# EAGLE design cv (EAGLE 7.4.0)
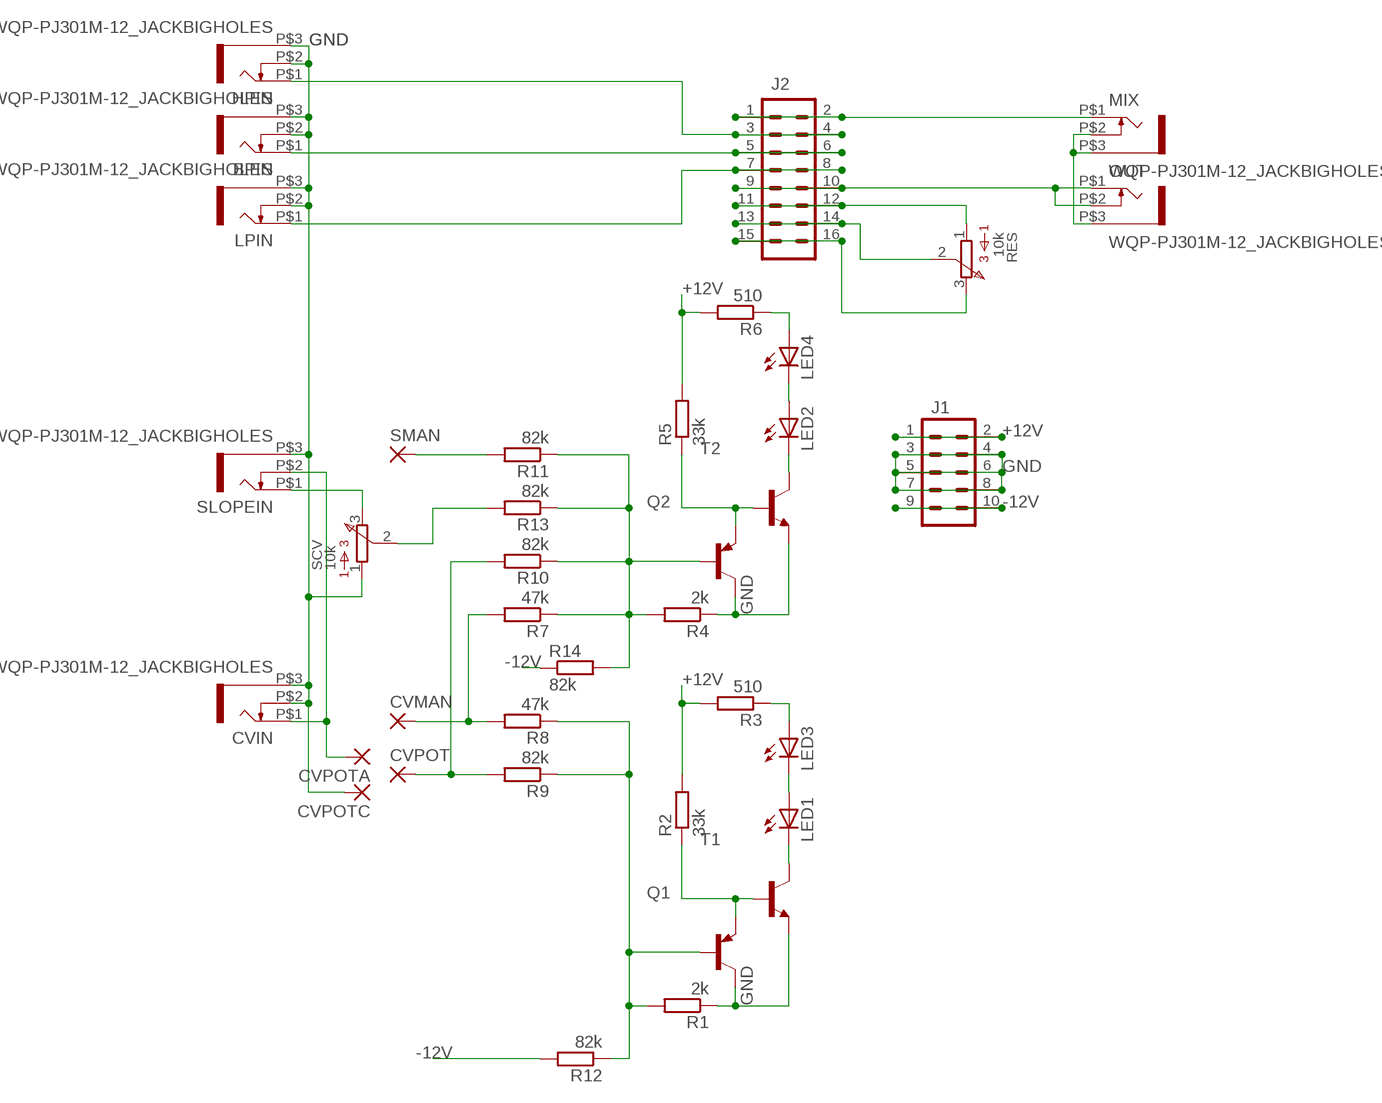
[diagram p0: schematic, sheet 1]

## Parts
BPIN  WQP-PJ301M-12_JACKBIGHOLES  [WQP-PJ301M-12_JACK]
CVIN  WQP-PJ301M-12_JACKBIGHOLES  [WQP-PJ301M-12_JACK]
CVMAN  2,0/0,9-S  [2,0/0,9-S]
CVPOT  2,0/0,9-S  [2,0/0,9-S]
CVPOTA  2,0/0,9-S  [2,0/0,9-S]
CVPOTC  2,0/0,9-S  [2,0/0,9-S]
HPIN  WQP-PJ301M-12_JACKBIGHOLES  [WQP-PJ301M-12_JACK]
J1  M05X2PTH  [AVR_ICSP]
J2  M08X2  [2X8]
LED1  LEDCHIP-LED0805  [CHIP-LED0805]
LED2  LEDCHIP-LED0805  [CHIP-LED0805]
LED3  LED5MM  [LED5MM]
LED4  LED5MM  [LED5MM]
LPIN  WQP-PJ301M-12_JACKBIGHOLES  [WQP-PJ301M-12_JACK]
MIX  WQP-PJ301M-12_JACKBIGHOLES  [WQP-PJ301M-12_JACK]
OUT  WQP-PJ301M-12_JACKBIGHOLES  [WQP-PJ301M-12_JACK]
Q1  MMBT3906LT1-PNP-SOT23-BEC  [SOT23-BEC]
Q2  MMBT3906LT1-PNP-SOT23-BEC  [SOT23-BEC]
R1  2k  R-EU_R1206  [R1206]
R2  33k  R-EU_R1206  [R1206]
R3  510  R-EU_R1206  [R1206]
R4  2k  R-EU_R1206  [R1206]
R5  33k  R-EU_R1206  [R1206]
R6  510  R-EU_R1206  [R1206]
R7  47k  R-EU_R1206  [R1206]
R8  47k  R-EU_R1206  [R1206]
R9  82k  R-EU_R1206  [R1206]
R10  82k  R-EU_R1206  [R1206]
R11  82k  R-EU_R1206  [R1206]
R12  82k  R-EU_R1206  [R1206]
R13  82k  R-EU_R1206  [R1206]
R14  82k  R-EU_R1206  [R1206]
RES  10k  91  [91]
SCV  10k  91  [91]
SLOPEIN  WQP-PJ301M-12_JACKBIGHOLES  [WQP-PJ301M-12_JACK]
SMAN  2,0/0,9-S  [2,0/0,9-S]
T1  MMBT3904LT1-NPN-SOT23-BEC  [SOT23-BEC]
T2  MMBT3904LT1-NPN-SOT23-BEC  [SOT23-BEC]

## Nets
+12V: J1.1 J1.2 R2.2 R3.2 R5.2 R6.2
-12V: J1.9 J1.10 R12.2 R14.1
GND: BPIN.P$2 BPIN.P$3 CVIN.P$2 CVIN.P$3 CVPOTC.1(P) HPIN.P$2 HPIN.P$3 J1.3 J1.4 J1.5 J1.6 J1.7 J1.8 LPIN.P$2 LPIN.P$3 MIX.P$2 MIX.P$3 OUT.P$3 Q1.C Q2.C R1.1 R4.1 SCV.1 SLOPEIN.P$3 T1.E T2.E
N$1: J2.1 J2.2 MIX.P$1
N$2: J2.7 J2.8 LPIN.P$1
N$3: J2.9 J2.10 OUT.P$1 OUT.P$2
N$4: CVIN.P$1 CVPOTA.1(P) SLOPEIN.P$2
N$5: SCV.3 SLOPEIN.P$1
N$7: BPIN.P$1 J2.5 J2.6
N$8: LED3.A R3.1
N$9: R13.2 SCV.2
N$10: CVPOT.1(P) R9.2 R10.2
N$11: Q1.B R1.2 R8.1 R9.1 R12.1
N$12: R11.2 SMAN.1(P)
N$13: CVMAN.1(P) R7.2 R8.2
N$14: Q1.E R2.1 T1.B
N$15: LED1.C T1.C
N$16: LED1.A LED3.K(C)
N$18: Q2.E R5.1 T2.B
N$19: HPIN.P$1 J2.3 J2.4
N$20: LED2.C T2.C
N$21: LED2.A LED4.K(C)
N$22: LED4.A R6.1
N$23: Q2.B R4.2 R7.1 R10.1 R11.1 R13.1 R14.2
RESPOTA: J2.11 J2.12 RES.1
RESPOTB: J2.13 J2.14 RES.2
RESPOTC: J2.15 J2.16 RES.3

## Library data of the parts
BPIN CVIN HPIN LPIN MIX OUT SLOPEIN = thonkiconn:WQP-PJ301M-12_JACK
CVMAN CVPOT CVPOTA CVPOTC SMAN = synthdiy:2,0/0,9-S: SQUARE THROUGH-HOLE PAD 2.0 mm, 0.9 mm/0.079",0.035"
J1 = SparkFun-Connectors:M05X2: Header 5x2 Standard 10-pin dual row 0.1" header. Commonly used with AVR-ISP. Use with Spark Fun Electronics SKU: PRT-00778
J2 = SparkFun-Connectors:M08X2: .1" headers, two rows of 8 each
LED1-LED4 = led:LED: LED OSRAM: - CHIPLED LG R971, LG N971, LY N971, LG Q971, LY Q971, LO R971, LY R971 LH N974, LH R974 LS Q976, LO Q976, LY Q976 LO Q996 - Hyper CHIPLED LW Q18S LB Q993, LB Q99A, LB R99A - SideLED LS A670, LO A670, LY A670, LG A670, LP A670 LB A673, LV A673, LT A673, LW A673 LH A674 LY A675 LS A676, LA A676, LO A676, LY A676, LW A676 LS A679, LY A679, LG A679 - Hyper Micro SIDELED® LS Y876, LA Y876, LO Y876, LY Y876 LT Y87S - SmartLED LW L88C, LW L88S LB L89C, LB L89S, LG L890 LS L89K, LO L89K, LY L89K LS L896, LA L896, LO L896, LY L896 - TOPLED LS T670, LO T670, LY T670, LG T670, LP T670 LSG T670, LSP T670, LSY T670, LOP T670, LYG T670 LG T671, LOG T671, LSG T671 LB T673, LV T673, LT T673, LW T673 LH T674 LS T676, LA T676, LO T676, LY T676, LB T676, LH T676, LSB T676, LW T676 LB T67C, LV T67C, LT T67C, LS T67K, LO T67K, LY T67K, LW E67C LS E67B, LA E67B, LO E67B, LY E67B, LB E67C, LV E67C, LT E67C LW T67C LS T679, LY T679, LG T679 LS T770, LO T770, LY T770, LG T770, LP T770 LB T773, LV T773, LT T773, LW T773 LH T774 LS E675, LA E675, LY E675, LS T675 LS T776, LA T776, LO T776, LY T776, LB T776 LHGB T686 LT T68C, LB T68C - Hyper Mini TOPLED® LB M676 - Mini TOPLED Santana® LG M470 LS M47K, LO M47K, LY M47K Source: http://www.osram.convergy.de LUXEON: - LUMILED® LXK2-PW12-R00, LXK2-PW12-S00, LXK2-PW14-U00, LXK2-PW14-V00 LXK2-PM12-R00, LXK2-PM12-S00, LXK2-PM14-U00 LXK2-PE12-Q00, LXK2-PE12-R00, LXK2-PE12-S00, LXK2-PE14-T00, LXK2-PE14-U00 LXK2-PB12-K00, LXK2-PB12-L00, LXK2-PB12-M00, LXK2-PB14-N00, LXK2-PB14-P00, LXK2-PB14-Q00 LXK2-PR12-L00, LXK2-PR12-M00, LXK2-PR14-Q00, LXK2-PR14-R00 LXK2-PD12-Q00, LXK2-PD12-R00, LXK2-PD12-S00 LXK2-PH12-R00, LXK2-PH12-S00 LXK2-PL12-P00, LXK2-PL12-Q00, LXK2-PL12-R00 Source: www.luxeon.com KINGBRIGHT: KA-3528ASYC Source: www.kingbright.com
Q1 Q2 = transistor:*-PNP-: PNP Transistror
R1-R14 = resistor:R-EU_: RESISTOR, European symbol
RES SCV = bourns:91: 91 Series Potentiometer
T1 T2 = transistor:*-NPN-: NPN Transistror BF959 corrected 2008.03.06

## Board
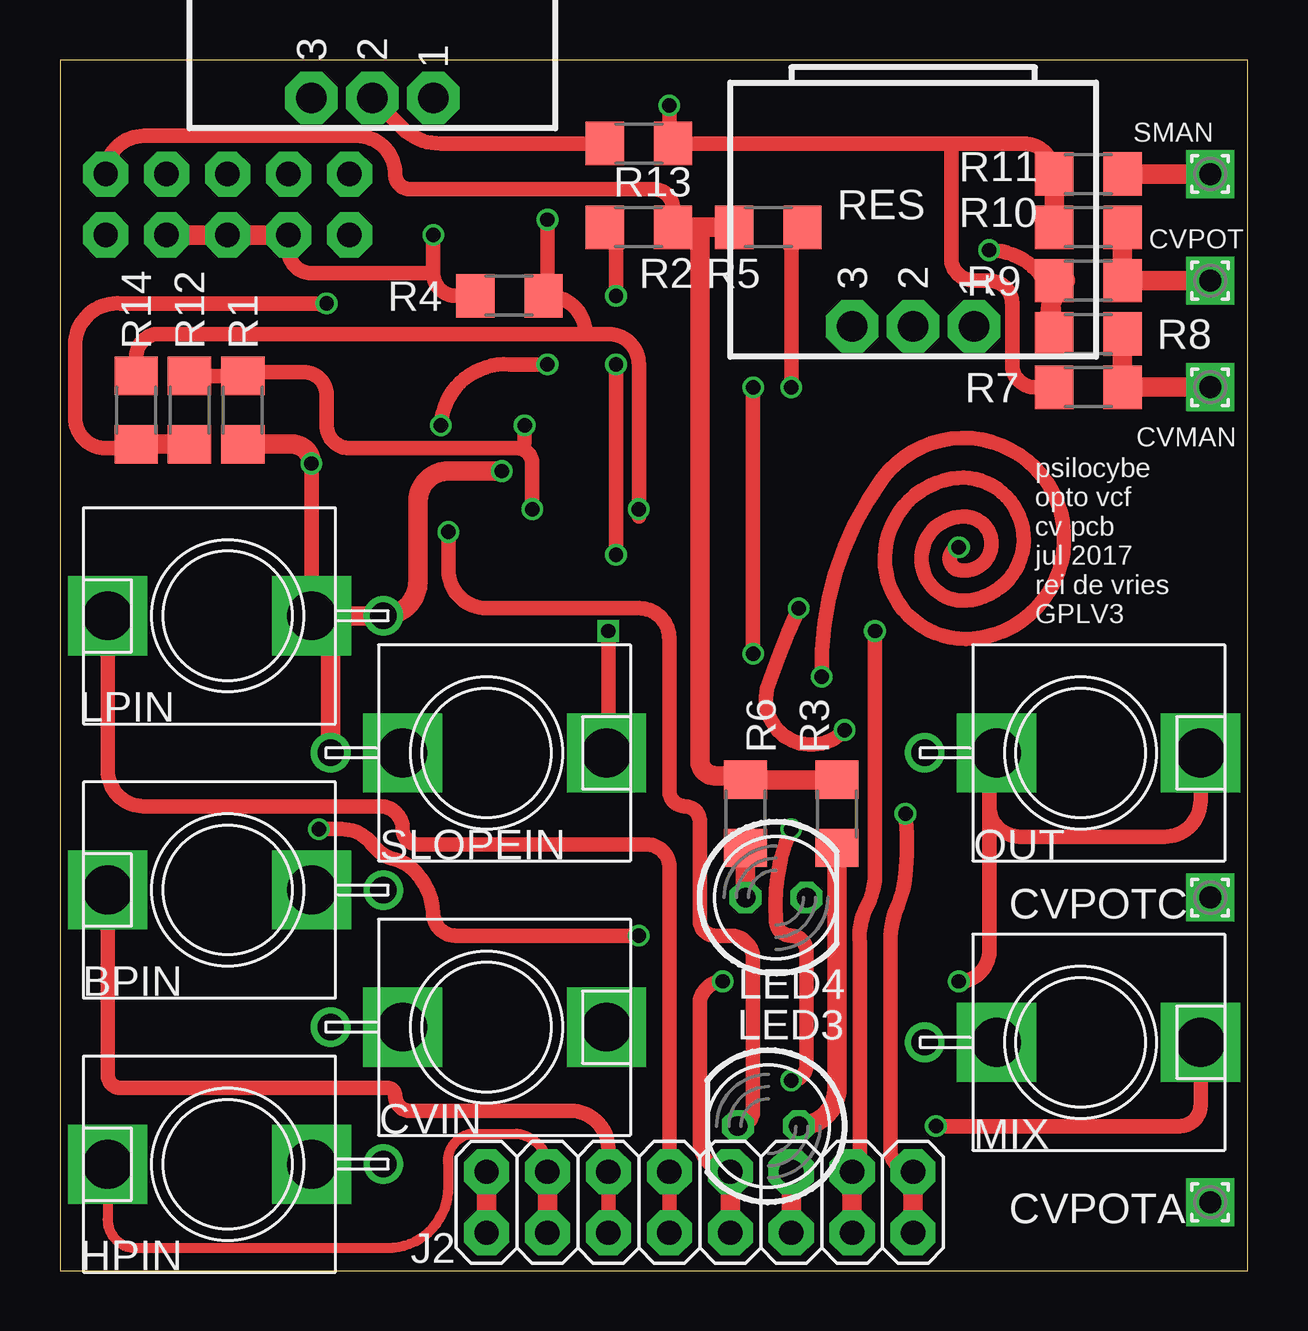
[diagram p1: board, top side]
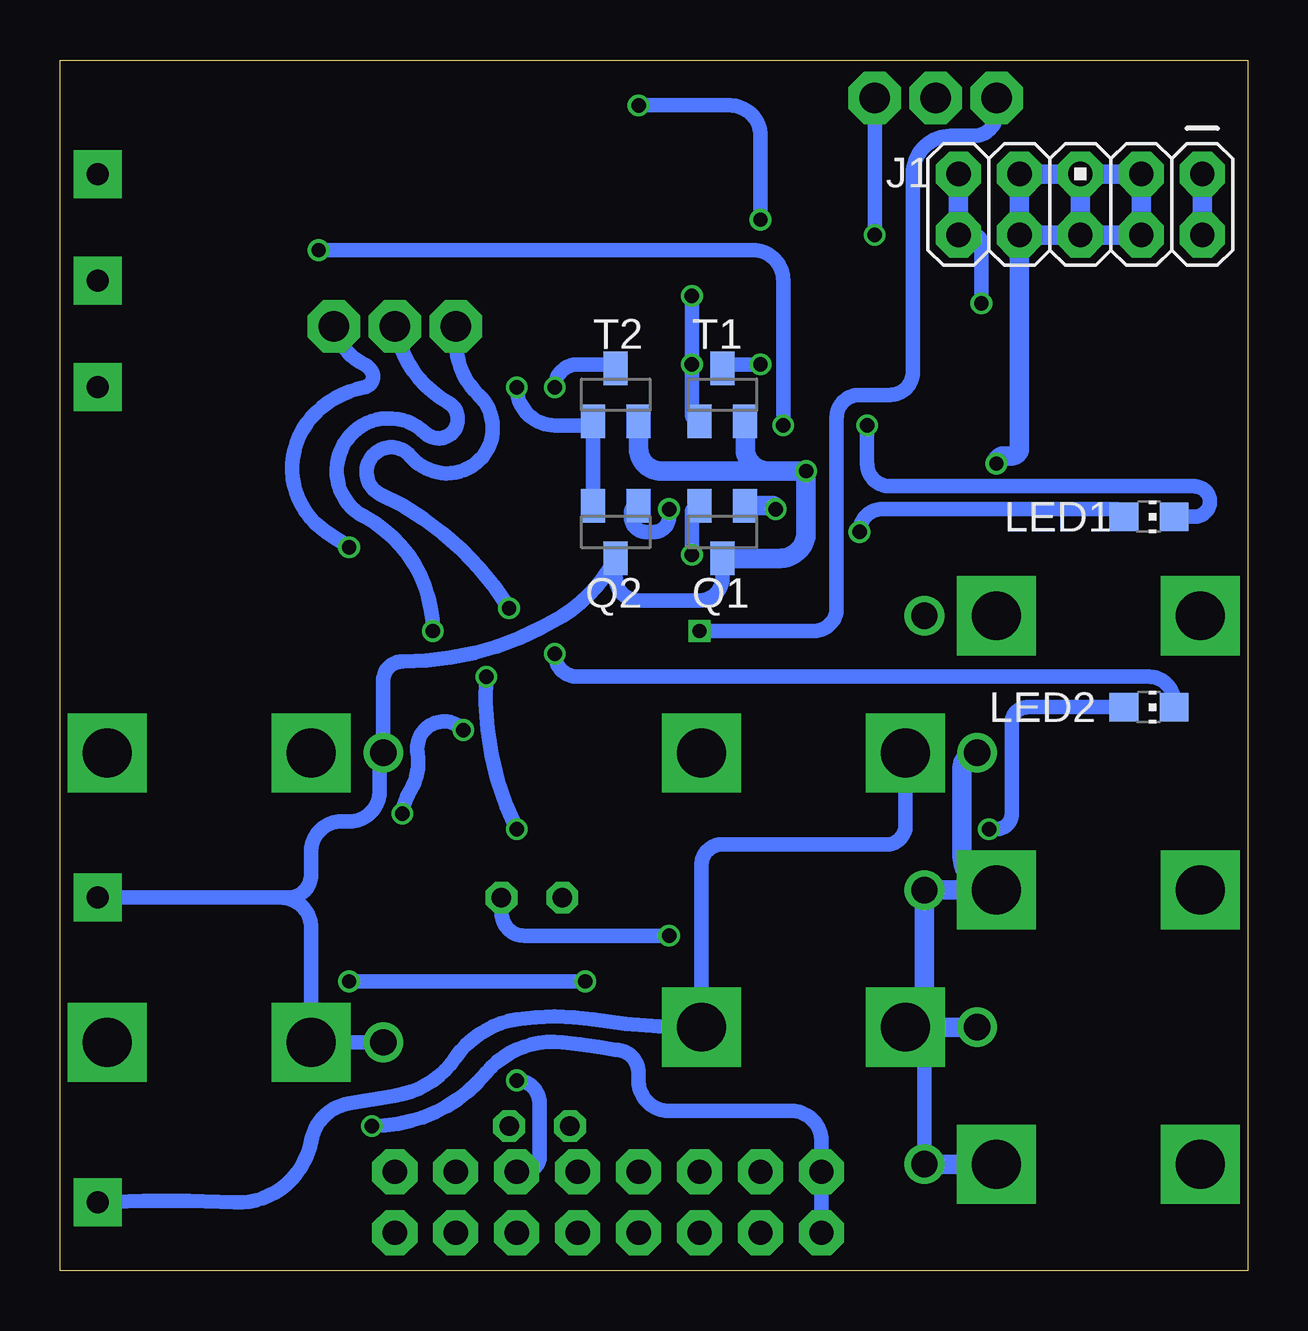
[diagram p2: board, bottom side, seen from below]

Size 49.52 x 50.47 mm. Coordinates in mm from the lower left corner, seen from the top.
Outline: 0,0 49.52,0 49.52,50.47 0,50.47 0,0
Copper layers (1*16): Top 0.035mm / dielectric 1.5mm / Bottom 0.035mm
Design rules "SeeedStudio_2layer_DRU_no_angle_20140221": minimum track width 6mil, minimum drill 12mil, track to track 6mil, track to pad 6mil, pad to pad 6mil, via to via 6mil, smd to smd 0mil, copper to edge 10mil, drill to drill 10mil, minimum pad ring 10mil, minimum via ring 6mil, stop-mask expansion 2mil, vias tented up to drill 100mil, thermal gap 10mil

### Footprints (pad centres in the part's own frame; a part is rotated, then mirrored left to right if it is on the bottom)
WQP-PJ301M-12_JACK = drill 2.032 pad 3.302 square: P$1 0,5; P$2 0,-3.5 | drill 1.1: P$3 0,-6.5
2,0/0,9-S = drill 0.914 pad 2 square: 1 0,0
AVR_ICSP = drill 1.016 pad 1.88 octagon: 1 -1.27,5.08; 2 1.27,5.08; 3 -1.27,2.54; 4 1.27,2.54; 5 -1.27,0; 6 1.27,0; 7 -1.27,-2.54; 8 1.27,-2.54; 9 -1.27,-5.08; 10 1.27,-5.08
2X8 = drill 1.016 pad 1.88 octagon: 1 0,0; 2 0,2.54; 3 2.54,0; 4 2.54,2.54; 5 5.08,0; 6 5.08,2.54; 7 7.62,0; 8 7.62,2.54; 9 10.16,0; 10 10.16,2.54; 11 12.7,0; 12 12.7,2.54; 13 15.24,0; 14 15.24,2.54; 15 17.78,0; 16 17.78,2.54
CHIP-LED0805 = smd 1.2 x 1.2: A 0,-1.05; C 0,1.05
LED5MM = drill 0.813 octagon: A -1.27,0; K 1.27,0
SOT23-BEC = smd 1 x 1.4: B -0.95,-1.1; C 0,1.1; E 0.95,-1.1
R1206 = smd 1.6 x 1.803: 1 -1.422,0; 2 1.422,0
91 = drill 1.27 pad 2.184 octagon: 1 0,2.54; 2 0,0; 3 0,-2.54

### Placement (x,y rotation side)
BPIN  6.99,15.88 90 top
CVIN  17.78,10.16 270 top
CVMAN  47.94,36.83 0 top
CVPOT  47.94,41.27 0 top
CVPOTA  47.94,2.86 0 top
CVPOTC  47.94,15.56 0 top
HPIN  6.99,4.45 90 top
J1  6.99,44.45 270 bottom
J2  17.78,1.59 0 top
LED1  4.13,31.43 270 bottom
LED2  4.13,23.5 270 bottom
LED3  29.53,6.03 180 top
LED4  29.84,15.56 0 top
LPIN  6.99,27.3 90 top
MIX  42.55,9.53 270 top
OUT  42.55,21.59 270 top
Q1  21.91,30.8 180 bottom
Q2  26.35,30.8 180 bottom
R1  7.62,35.88 90 top
R2  24.13,43.5 0 top
R3  32.38,19.05 90 top
R4  18.73,40.64 0 top
R5  29.53,43.5 180 top
R6  28.57,19.05 90 top
R7  42.86,36.83 0 top
R8  42.86,39.05 0 top
R9  42.86,41.27 0 top
R10  42.86,43.5 0 top
R11  42.86,45.72 0 top
R12  5.4,35.88 270 top
R13  24.13,46.99 180 top
R14  3.17,35.88 90 top
RES  35.56,39.37 270 top
SCV  13.02,48.9 270 top
SLOPEIN  17.78,21.59 270 top
SMAN  47.94,45.72 0 top
T1  21.91,36.51 0 bottom
T2  26.35,36.51 0 bottom

### Tracks (layer width: path | path; a pad name or v marks a point on that pad's centre or on a via)
+12V
  Top 0.61: R2.2 25.55,44.3 arc90 24.77,45.09 14.61,45.09 arc-90 13.97,45.72 arc90 12.38,47.31 3.49,47.31 arc90 J1.1
  Top 0.813: R2.2 26.67,43.5 | R5.2 26.67,43.5 | 26.67,43.5 26.67,21.27 arc90 27.3,20.64 28.41,20.64 arc-90 R6.2 R3.2
  Bottom 0.813: J1.2 J1.1
-12V  (via drill 0.6)
  Top 0.61: v11.11,40.32 arc-90 10.79,40.32 2.54,40.32 arc90 0.64,38.73 0.64,35.56 arc90 1.91,34.29 3.01,34.29 arc90 R14.1
  Top 0.813: R12.2 R14.1
  Bottom 0.61: J1.10 11.43,43.18 arc90 11.11,42.86 v11.11,40.32
  Bottom 0.813: J1.10 J1.9
GND  (via drill 0.6)
  Top 0.61: LPIN.P$2 v10.48,33.65 | 15.56,41.59 arc90 16.51,40.64 R4.1 | 15.56,41.59 10.48,41.59 arc-90 9.53,42.55 J1.8 | v15.56,43.18 15.56,41.59
  Top 0.813: J1.4 J1.6 J1.8 | SLOPEIN.P$3 11.28,26.51 arc90 LPIN.P$2 LPIN.P$3 arc90 14.92,28.74 14.92,32.07 arc-90 16.19,33.34 v18.41,33.34 | v10.48,33.65 arc90 9.68,34.46 R1.1
  Bottom 0.61: HPIN.P$3 13.48,9.05 arc-90 CVIN.P$2 | SCV.1 v15.56,43.18 | 40.32,15.56 arc90 39.05,14.28 MIX.P$2 MIX.P$3 | 40.32,15.56 CVPOTC.1 | 40.32,15.56 40.01,15.56 arc-90 39.05,16.51 39.05,17.46 arc90 37.78,18.73 37.47,18.73 arc-90 36.2,20 36.2,21.44 arc90 OUT.P$3 36.05,24.6 arc90 35.24,25.4 arc-32 28.57,27.3 arc-30 Q2.C | 26.52,29.53 arc-90 Q2.C | Q1.C 21.91,28.89 arc90 22.86,27.94 25.4,27.94 arc90 26.35,28.89 Q2.C
  Bottom 0.813: CVIN.P$3 CVIN.P$2 arc-90 13.48,10.32 BPIN.P$3 BPIN.P$2 arc90 11.91,17.3 11.91,20.95 arc90 SLOPEIN.P$3 | HPIN.P$3 HPIN.P$2 | J1.6 J1.5 | J1.5 J1.7 J1.8 | J1.5 J1.3 J1.4 J1.6 | J1.8 J1.6 | 20,33.34 v18.41,33.34 18.41,30.8 arc90 19.52,29.7 Q1.C | 20,33.34 arc90 20.95,34.29 T1.E arc-90 T1.E | 20,33.34 24.45,33.34 arc90 25.4,34.29 T2.E arc-90 T2.E | J1.8 9.53,34.29 arc90 9.84,33.97 10.16,33.97 arc-90 v10.48,33.65
N$1  (via drill 0.6)
  Top 0.61: MIX.P$1 47.55,6.91 arc-90 46.67,6.03 v36.51,6.03
  Top 0.813: J2.1 J2.2
  Bottom 0.61: J2.1 J2.2 17.78,5.4 arc-90 19.05,6.67 24.13,6.67 arc90 25.4,7.94 25.4,8.26 arc-90 26.35,9.21 arc-3 28.57,9.53 arc-56 31.75,8.26 arc50 v36.51,6.03
N$2
  Top 0.61: LPIN.P$1 1.99,20.88 arc90 3.49,19.37 13.34,19.37 arc-90 14.29,18.41 arc90 14.92,17.78 24.45,17.78 arc-90 25.4,16.83 J2.8 J2.7
N$3  (via drill 0.6)
  Top 0.61: OUT.P$1 47.55,19.61 arc-90 46.04,18.1 40.01,18.1 arc-90 38.73,19.37 | 38.73,19.37 38.73,21.28 | 38.73,21.28 arc-90 OUT.P$2 arc90 38.73,21.28 | 38.73,19.37 38.73,13.34 arc-90 v37.47,12.06 | v27.62,12.06 arc90 26.67,11.11 26.67,5.4 arc90 J2.10
  Top 0.813: J2.10 J2.9
  Bottom 0.61: v37.47,12.06 v27.62,12.06
N$4
  Bottom 0.61: SLOPEIN.P$2 arc-90 SLOPEIN.P$2 14.29,18.41 arc90 15.24,17.78 21.91,17.78 arc-90 22.78,16.91 CVIN.P$1 23.18,10.16 arc9 27.3,10.48 arc-18 30.48,10.48 arc-46 33.02,8.89 arc46 35.56,7.3 arc-1 37.47,6.99 arc-70 39.05,5.4 arc82 42.23,2.86 arc-5 CVPOTA.1
N$5  (via drill 0.6)
  Top 0.61: v22.86,26.67 22.86,21.67 arc-90 SLOPEIN.P$1
  Bottom 0.61: v22.86,26.67 18.1,26.67 arc-90 17.14,27.62 17.14,35.56 arc90 16.19,36.51 14.92,36.51 arc-90 13.97,37.47 13.97,45.72 arc90 12.38,47.31 11.43,47.31 arc-90 10.48,48.26 SCV.3
N$7
  Top 0.61: J2.5 J2.6 22.86,5.08 arc90 21.27,6.67 14.61,6.67 arc-90 13.97,7.3 arc90 13.65,7.62 2.54,7.62 arc-90 1.99,8.18 BPIN.P$1
N$8
  Top 0.813: R3.1 32.38,7.62 arc-90 LED3.A
N$9
  Top 0.61: SCV.2 14.29,47.62 arc46 15.88,46.99 R13.2
N$10
  Top 0.813: CVPOT.1 R9.2 R10.2
N$11  (via drill 0.6)
  Top 0.61: R12.1 R1.2 | v19.68,31.75 19.68,33.66 arc90 19.05,34.29 | 7.79,37.47 arc90 R1.2 | 19.05,34.29 12.06,34.29 arc-90 11.11,35.24 11.11,36.51 arc90 10.16,37.47 7.79,37.47 | 7.79,37.47 arc90 R1.2 | R8.1 41.44,39.84 arc90 v38.73,42.55 | v19.37,35.24 19.37,34.61 arc-90 19.05,34.29
  Top 0.813: R9.1 arc-145 41.91,41.27 arc73 R8.1
  Bottom 0.61: v38.73,42.55 20.64,42.55 arc90 19.37,41.27 v19.37,35.24
  Bottom 0.813: Q1.B 19.83,31.9 arc90 v19.68,31.75
N$12
  Top 0.813: R11.2 SMAN.1
N$13
  Top 0.813: CVMAN.1 R7.2 R8.2
N$14  (via drill 0.6)
  Top 0.61: v23.18,29.84 v23.18,37.78 | R2.1 22.71,43.33 arc90 23.18,42.86 v23.18,40.64
  Bottom 0.61: Q1.E arc-90 23.18,31.58 v23.18,29.84 | T1.B arc90 23.18,35.73 v23.18,37.78 v23.18,40.64
N$15  (via drill 0.6)
  Top 0.61: v15.88,35.24 arc-90 18.73,37.78 v20.32,37.78
  Bottom 0.61: v15.88,35.24 15.88,33.66 arc-90 14.92,32.7 2.22,32.7 arc90 1.59,32.07 arc90 2.22,31.43 LED1.C | v20.32,37.78 21.74,37.78 arc-90 T1.C
N$16  (via drill 0.6)
  Top 0.61: LED3.K arc90 28.89,6.67 28.89,13.02 arc90 27.94,13.97 27.3,13.97 arc-90 26.67,14.61 26.67,18.73 arc90 26.04,19.37 arc-90 25.4,20 25.4,26.35 arc90 24.13,27.62 17.78,27.62 arc-90 16.19,29.21 v16.19,30.8
  Bottom 0.61: v16.19,30.8 arc90 15.24,31.75 5.5,31.75 arc90 LED1.A
N$18  (via drill 0.6)
  Top 0.61: R5.1 arc90 30.48,43.03 v30.48,36.83
  Bottom 0.61: Q2.E T2.B arc90 27.47,35.24 28.89,35.24 arc90 v30.48,36.83
N$19
  Top 0.406: HPIN.P$1 1.99,2.14 arc90 3.17,0.95 13.65,0.95 arc90 16.19,3.49 16.19,4.45 arc-90 17.14,5.71 19.05,5.71 arc-90 J2.4
  Top 0.813: J2.4 J2.3
N$20  (via drill 0.6)
  Top 0.61: v28.89,36.83 v28.89,25.72
  Bottom 0.61: LED2.C 3.08,23.71 arc-90 4.13,24.77 27.94,24.77 arc90 v28.89,25.72 | v28.89,36.83 arc90 27.94,37.78 26.52,37.78 arc90 T2.C
N$21  (via drill 0.6)
  Top 0.61: v24.13,13.97 16.51,13.97 arc-90 15.56,14.92 arc37 14.92,16.51 arc39 13.97,17.14 arc-39 13.02,17.78 arc53 11.75,18.41 v10.79,18.41
  Bottom 0.61: LED4.K 31.11,14.92 arc-90 30.16,13.97 v24.13,13.97 | v10.79,18.41 10.48,18.41 arc-90 9.84,19.05 9.84,22.86 arc90 9.21,23.5 LED2.A
N$22
  Top 0.813: R6.1 LED4.A
N$23  (via drill 0.6)
  Top 0.61: R14.2 3.17,38.1 arc-90 4.13,39.05 21.91,39.05 | 21.91,39.05 22.86,39.05 arc-90 24.13,37.78 v24.13,31.75 24.13,31.43 | R4.2 20.32,40.64 | 20.32,40.64 arc-90 21.91,39.05 | 37.15,46.99 R13.1 arc-90 25.4,47.14 v25.4,48.58 | 37.15,46.99 40.17,46.99 arc-90 R11.1 | R7.1 40.64,36.83 arc-90 39.69,37.78 39.69,40.32 arc90 38.73,41.27 38.1,41.27 arc-90 37.15,42.23 37.15,46.99 | 20.32,40.64 v20.32,43.81
  Top 0.813: R11.1 R10.1
  Bottom 0.61: v24.13,31.75 24.13,31.43 arc90 24.77,30.8 25.08,30.8 arc90 25.72,31.43 25.72,31.58 arc90 Q2.B | v20.32,43.81 20.32,47.31 arc-90 21.59,48.58 v25.4,48.58
RESPOTA  (via drill 0.6)
  Top 0.61: v30.48,7.94 arc90 31.11,8.57 31.11,13.34 arc90 30.48,13.97 arc-90 29.84,14.61 arc-28 v30.48,18.41 | v31.75,24.77 arc-38 34.29,33.02 arc-227 38.1,26.35 arc-176 37.15,33.02 arc-186 37.78,27.94 arc-188 37.78,31.43 arc-188 37.47,29.21 arc-155 v37.47,30.16
  Top 0.813: J2.12 J2.11
  Bottom 0.61: J2.12 30.16,4.13 arc-90 29.53,4.76 29.53,6.99 arc-90 v30.48,7.94 | v30.48,18.41 arc30 v31.75,24.77 | v37.47,30.16 38.42,30.8 arc97 39.05,35.56 arc38 36.83,36.83 arc-106 36.51,37.47 arc-37 36.83,37.78 arc50 RES.1
RESPOTB  (via drill 0.6)
  Top 0.61: v33.97,26.67 33.97,16.51 arc-28 33.66,15.24 arc34 33.34,13.65 33.34,4.45 arc-90 J2.14
  Top 0.813: J2.14 J2.13
  Bottom 0.61: v33.97,26.67 arc-62 36.83,31.43 arc196 34.29,34.92 arc-194 33.34,36.2 arc51 RES.2
RESPOTC  (via drill 0.6)
  Top 0.61: J2.16 arc-90 34.61,5.08 34.61,13.65 arc-23 34.92,15.24 arc17 35.24,16.51 arc11 v35.24,19.05 | v32.7,22.54 arc-157 29.53,24.45 arc-5 v30.8,27.62
  Top 0.813: J2.16 J2.15
  Bottom 0.61: RES.3 33.02,38.73 arc-46 32.07,36.51 arc155 33.97,33.34 arc31 34.92,33.97 arc-201 36.2,32.38 arc33 v30.8,27.62 | v32.7,22.54 arc-148 34.61,21.59 arc40 34.92,20 arc-26 v35.24,19.05

### Text on the board
tNames: psilocybe / opto vcf / cv pcb / jul 2017 / rei de vries / GPLV3